# Altium project Capstone_Thermostat.PrjPcb
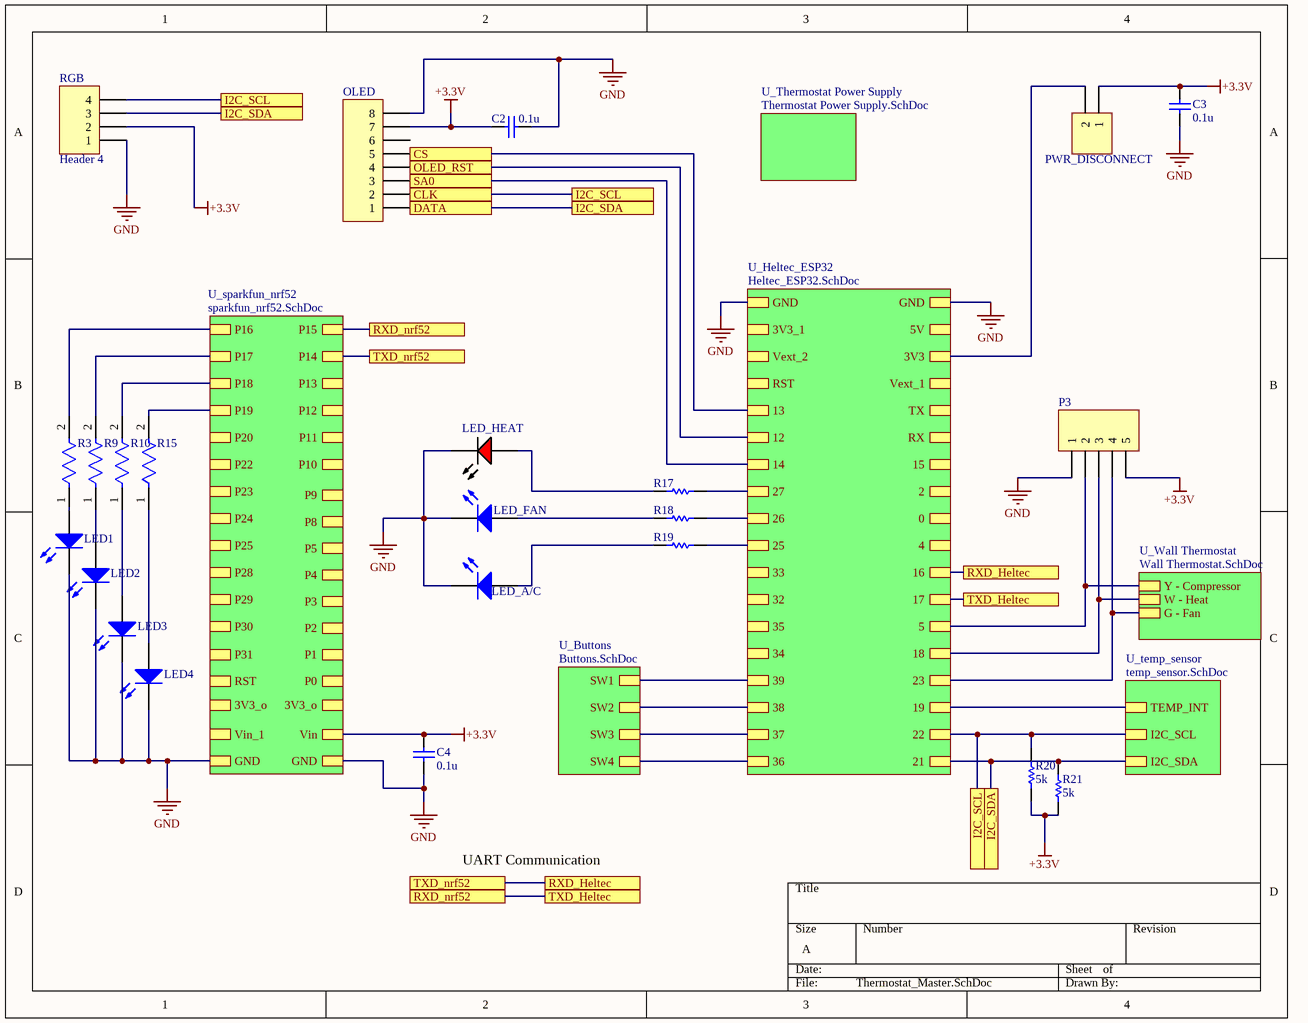
[diagram p0: Thermostat_Master.SchDoc]
7 sheets, 75 parts. Net scope: hierarchical (ports join the sheet entries above them; power ports are global).
Board file: Thermostat_PCB.PcbDoc
Sheets:
  Thermostat_Master.SchDoc
    U_sparkfun_nrf52 = sparkfun_nrf52.SchDoc
    U_Heltec_ESP32 = Heltec_ESP32.SchDoc
    U_temp_sensor = temp_sensor.SchDoc
    U_Wall Thermostat = Wall Thermostat.SchDoc
    U_Thermostat Power Supply = Thermostat Power Supply.SchDoc
    U_Buttons = Buttons.SchDoc

## Sheet Thermostat_Master.SchDoc
size A

### Parts
C2  0.1u  [CAPC2013X145X50LL20T25]
C3  0.1u  [CAPC2013X145X50LL20T25]
C4  0.1u  [CAPC2013X145X50LL20T25]
LED1  (no value)  [1206_A]
LED2  (no value)  [1206_A]
LED3  (no value)  [1206_A]
LED4  (no value)  [1206_A]
LED_A/C  (no value)  [1206_A]
LED_FAN  (no value)  [1206_A]
LED_HEAT  LTST-C150KRKT  [LTST-C150KRKT_V]  (value not drawn)
OLED  Header 8  [HDR1X8]  (value not drawn)
P3  Header 5  [HDR1X5]  (value not drawn)
PWR_DISCONNECT  Header 2  [HDR1X2]  (value not drawn)
R3  (no value)  [FP-RC1206-MFG]
R9  (no value)  [FP-RC1206-MFG]
R10  (no value)  [FP-RC1206-MFG]
R15  (no value)  [FP-RC1206-MFG]
R17  RC0805FR-07100RL  [RESC2013X60X35ML10T20]  (value not drawn)
R18  RC0805FR-07100RL  [RESC2013X60X35ML10T20]  (value not drawn)
R19  RC0805FR-07100RL  [RESC2013X60X35ML10T20]  (value not drawn)
R20  5k  [RESC2013X70X40LL20T20]
R21  5k  [RESC2013X70X40LL20T20]
RGB  Header 4  [HDR1X4]

### Sub-sheets
U_Buttons = Buttons.SchDoc: SW1, SW3, SW4, SW2
U_Heltec_ESP32 = Heltec_ESP32.SchDoc: GND, 5V, 3V3, Vext_1, TX, RX, 15, 2, 0, 4, 16, 17, 5, 18, 23, 19, 22, 21, GND, 3V3_1, Vext_2, RST, 13, 12, 14, 27, 26, 25, 33, 32, 35, 34, 39, 38, 37, 36
U_sparkfun_nrf52 = sparkfun_nrf52.SchDoc: P16, P17, P18, P19, P20, P22, P23, P24, P25, P28, P29, P30, P31, RST, Vin_1, GND, P15, P14, P13, P12, P11, P10, P9, P8, P5, P4, P3, P2, P1, P0, GND, 3V3_o, 3V3_o, Vin
U_temp_sensor = temp_sensor.SchDoc: I2C_SCL, TEMP_INT, I2C_SDA
U_Thermostat Power Supply = Thermostat Power Supply.SchDoc: no entries
U_Wall Thermostat = Wall Thermostat.SchDoc: Y - Compressor, W - Heat, G - Fan

### Ports
CLK, CS, DATA, I2C_SCL, I2C_SDA, OLED_RST, RXD_Heltec, RXD_nrf52, SA0, TXD_Heltec, TXD_nrf52

### Nets
+3.3V: C2.2 C3.2 C4.2 OLED.7 P3.5 PWR_DISCONNECT.1 R20.1 R21.1 RGB.2 ; sheet U_sparkfun_nrf52/Vin
GND: C2.1 C3.1 C4.1 LED1.1(K) LED2.1(K) LED3.1(K) LED4.1(K) LED_A/C.1(K) LED_FAN.1(K) LED_HEAT.2(K) OLED.8 P3.1 RGB.1 ; sheet U_sparkfun_nrf52/GND, sheet U_sparkfun_nrf52/GND, sheet U_Heltec_ESP32/GND, sheet U_Heltec_ESP32/GND
NetLED1_2: LED1.2(A) R3.1
NetLED2_2: LED2.2(A) R9.1
NetLED3_2: LED3.2(A) R10.1
NetLED4_2: LED4.2(A) R15.1
NetLED_A/C_2: LED_A/C.2(A) R19.1
NetLED_FAN_2: LED_FAN.2(A) R18.1
NetLED_HEAT_1: LED_HEAT.1(A) R17.1
NetOLED_1: OLED.1 R21.2 RGB.3 ; port DATA, port I2C_SDA, sheet U_Heltec_ESP32/21, sheet U_temp_sensor/I2C_SDA
NetOLED_2: OLED.2 R20.2 RGB.4 ; port CLK, port I2C_SCL, sheet U_Heltec_ESP32/22, sheet U_temp_sensor/I2C_SCL
NetOLED_3: OLED.3 ; port SA0, sheet U_Heltec_ESP32/14
NetOLED_4: OLED.4 ; port OLED_RST, sheet U_Heltec_ESP32/12
NetOLED_5: OLED.5 ; port CS, sheet U_Heltec_ESP32/13
NetP1_8: R17.2 ; sheet U_Heltec_ESP32/27
NetP1_9: R18.2 ; sheet U_Heltec_ESP32/26
NetP1_10: R19.2 ; sheet U_Heltec_ESP32/25
NetP1_15: sheet U_Heltec_ESP32/39, sheet U_Buttons/SW1
NetP1_16: sheet U_Heltec_ESP32/38, sheet U_Buttons/SW2
NetP1_17: sheet U_Heltec_ESP32/37, sheet U_Buttons/SW3
NetP1_18: sheet U_Heltec_ESP32/36, sheet U_Buttons/SW4
NetP2_3: sheet U_Heltec_ESP32/19, sheet U_temp_sensor/TEMP_INT
NetP2_4: P3.4 ; sheet U_Heltec_ESP32/23, sheet U_Wall Thermostat/G - Fan
NetP2_5: P3.3 ; sheet U_Heltec_ESP32/18, sheet U_Wall Thermostat/W - Heat
NetP2_6: P3.2 ; sheet U_Heltec_ESP32/5, sheet U_Wall Thermostat/Y - Compressor
NetP2_7: port TXD_Heltec, port RXD_nrf52, sheet U_sparkfun_nrf52/P15, sheet U_Heltec_ESP32/17
NetP2_8: port RXD_Heltec, port TXD_nrf52, sheet U_sparkfun_nrf52/P14, sheet U_Heltec_ESP32/16
NetP2_16: PWR_DISCONNECT.2 ; sheet U_Heltec_ESP32/3V3
NetPL1_3: sheet U_sparkfun_nrf52/3V3_o, sheet U_sparkfun_nrf52/3V3_o
NetPL1_14: R15.2 ; sheet U_sparkfun_nrf52/P19
NetPL1_15: R10.2 ; sheet U_sparkfun_nrf52/P18
NetPL1_16: R9.2 ; sheet U_sparkfun_nrf52/P17
NetPL1_17: R3.2 ; sheet U_sparkfun_nrf52/P16

Not connected (* = marked no-connect by the designer): OLED 6

### Notes on the sheet
- UART Communication

### Library data of the parts
C2-C4 = CMP-2007-01258-1: C0805C104Z5VACTU; Manufacturer: Kemet; Part Number: C0805C104Z5VACTU
LED1-LED4 = CMP-1426-00016-1: QTLP650C4TR / 1206 green led; PartNumber: 150120VS75000; Manufacturer: Wuerth Elektronik; Color: Bright Green; ComponentLink2URL: http://katalog.we-online.com/led/datasheet/150120VS75000.pdf; ComponentLink2Description: Datasheet; ComponentLink1URL: http://www.we-online.com; PackageReference: 1206_A; ComponentLink1Description: Manufacturer URL
LED_A/C = CMP-1426-00016-1: QTLP650C4TR / 1206 green led; PartNumber: LTST-C150TBKT; ComponentLink2URL: http://katalog.we-online.com/led/datasheet/150120VS75000.pdf; Color: Blue; ComponentLink2Description: Datasheet; ComponentLink1URL: http://www.we-online.com; PackageReference: 1206_A; ComponentLink1Description: Manufacturer URL
LED_FAN = CMP-1426-00016-1: LTST-C150GKT / 1206 green led; ComponentLink2URL: http://katalog.we-online.com/led/datasheet/150120VS75000.pdf; PartNumber: LTST-C150GKT; Color: Bright Green; ComponentLink2Description: Datasheet; ComponentLink1URL: http://www.we-online.com; PackageReference: 1206_A; ComponentLink1Description: Manufacturer URL
LED_HEAT = CMP-2000-06617-1: LED Red, 62.5 mW, 50 mA, -30 to 85 degC, 2-Pin SMD, RoHS, Tape and Reel; Manufacturer: Lite-On; Chip Material: AlGaInP; Product Depth (mm): 1.6mm; Luminous Intensity: 54mcd; Number of  Elements: 1; Reverse Voltage: 5V; Viewing Angle: 130deg; Rad Hardened: No; Shape Type: Rectangular; Peak Wavelength: 639nm; Forward Current: 30mA; Main Category: ChipLED; Product Height (mm): 1.1mm; Forward Voltage: 2.4V; Product Length (mm): 3.2mm; High Brightness: Yes; DELETED: Compliant; Test Current (It): 20mA; Power Dissipation: 75W; Dominant Wave Length: 631nm; Mounting: SurfaceMount; Package Type: ChipLed; Manufacturer URL: http://www.us.liteon.com/; Datasheet Version: Rev. C, 01/2013; Lens Dimensions: 2.06X1.6X0.6mm; Package Reference: C150KRKT; Operating Temp Range: -55Cto85C; Packaging: TapeandReel; Package Description: 2-Pin Surface Mount Device, Body 3.2 x 1.6 mm; Lum Intensity: 54mcd; Datasheet URL: http://optoelectronics.liteon.com/upload/download/DS-22-99-0149/S_110_LTST-C150KRKT.pdf; Emitting Color: Red; Operating Temperature Classification: Industrial; Mounting Technology: SurfaceMount; Type: Uni-Color; Pin Count: 2
OLED = Header 8: Header, 8-Pin; LatestRevisionDate: 17-Jul-2002; LatestRevisionNote: Re-released for DXP Platform.; Publisher: Altium Limited
P3 = Header 5: Header, 5-Pin; LatestRevisionDate: 17-Jul-2002; LatestRevisionNote: Re-released for DXP Platform.; Publisher: Altium Limited
PWR_DISCONNECT = Header 2: Header, 2-Pin; LatestRevisionDate: 17-Jul-2002; LatestRevisionNote: Re-released for DXP Platform.; Publisher: Altium Limited
R3 R9 R10 R15 = CMP-03412-007570-1: 360 ohms resistor / 1206 package; Manufacturer Part Number: RC1206JR-070RL; Manufacturer: YAGEO; Voltage Rating: 200V; Temperature Coefficient: 300ppm/°C; Power Rating: 0.25W; Value: 0Ω; Tolerance: 5%; Temperature Range Low: -55°C; Category: Res; Automotive: No; Ipc Land Pattern Name: RESC310160X55; Device Class L1: Passive Components; Temperature: -55°C to +155°C; ComponentLink2URL: https://www.yageo.com/upload/media/product/productsearch/datasheet/rchip/PYu-RC_Group_51_RoHS_L_10.pdf; Lead Free: Yes; Height: 0.65mm; Footprint Url: https://www.yageo.com/upload/website/yageo_PYu-R_Mount_10_19050818_343.pdf; Package: RC1206; Digikey Description: RES SMD 0 OHM JUMPER 1/4W 1206; Temperature Range High: +155°C; Device Class L3: Chip SMD Resistors; Device Class L2: Resistors; Octopart: https://octopart.com/rc1206jr-070rl-yageo-40025601; Resistance: 0Ω; Series: RC; ComponentLink2Description: Datasheet; Composition: Thick Film; RoHS: TRUE; Mouser Description: Resistor: thick film; SMD; 1206; 0O; 0.25W; ±5%; -55÷155°C
R17-R19 = CMP-2100-03669-1: Chip Resistor, 100 Ohm, +/-1%, 0.125 W, -55 to 155 degC, 0805 (2012 Metric), RoHS, Tape and Reel; Manufacturer: Yageo; Power Rating: 125mW; Resistance: 100Ohm; Voltage Rating: 150V; Tolerance: 1%; Temperature Coefficient: 100ppm/degreesC; Length: 2mm; Package Description: 2-Pin Surface Mounted Device, Body 2 x 1.25 mm; Case Code (Imperial): 0805; Number of Pins: 2; Termination: SMD/SMT; Lead Pitch: 0.4mm; Package Quantity: 1; Height: 0.024inch; Case Code (Metric): 2012; Number of Terminations: 2; Datasheet Version: Rev. 5, 10/2016; Lead Free: LeadFree; Package Reference: 0805; Composition: ThickFilm; REACH SVHC: Unknown; Voltage Rating (DC): 150V; Min Operating Temperature: -55degC; Packaging: TapeandReel; Military Standard: Not; Case/Package: 0805; Datasheet URL: http://www.yageo.com/NewPortal/yageodocoutput?fileName=/pdf/R-Chip/PYu-RC_Group_51_RoHS_L_5.pdf; Max Operating Temperature: 155degC; Manufacturer URL: http://www.yageo.com/; Max Power Dissipation: 125mW; Width: 0.049inch; Depth: 1.25mm; RoHSCompliant: true
R20 R21 = CMP-2001-00419-1: 2012; Part Number: ERJ-6GEYJ471V; Manufacturer: Panasonic
RGB = Header 4: Header, 4-Pin; LatestRevisionDate: 17-Jul-2002; LatestRevisionNote: Re-released for DXP Platform.; Publisher: Altium Limited

## Sheet sparkfun_nrf52.SchDoc
size A4
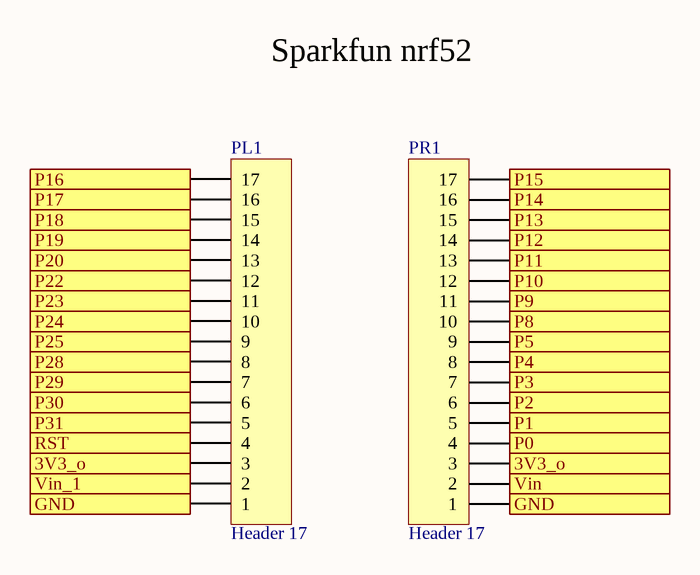
[diagram p1: sparkfun_nrf52.SchDoc]

### Parts
PL1  Header 17  [HDR1X17]
PR1  Header 17  [HDR1X17]

### Ports
3V3_o, GND, P0, P1, P2, P3, P4, P5, P8, P9, P10, P11, P12, P13, P14, P15, P16, P17, P18, P19, P20, P22, P23, P24, P25, P28, P29, P30, P31, RST, Vin, Vin_1

### Nets
+3.3V: PR1.2 ; port Vin
GND: PL1.1 PR1.1 ; port GND
NetP2_7: PR1.17 ; port P15
NetP2_8: PR1.16 ; port P14
NetPL1_2: PL1.2 ; port Vin_1
NetPL1_3: PL1.3 PR1.3 ; port 3V3_o
NetPL1_4: PL1.4 ; port RST
NetPL1_5: PL1.5 ; port P31
NetPL1_6: PL1.6 ; port P30
NetPL1_7: PL1.7 ; port P29
NetPL1_8: PL1.8 ; port P28
NetPL1_9: PL1.9 ; port P25
NetPL1_10: PL1.10 ; port P24
NetPL1_11: PL1.11 ; port P23
NetPL1_12: PL1.12 ; port P22
NetPL1_13: PL1.13 ; port P20
NetPL1_14: PL1.14 ; port P19
NetPL1_15: PL1.15 ; port P18
NetPL1_16: PL1.16 ; port P17
NetPL1_17: PL1.17 ; port P16
NetPR1_4: PR1.4 ; port P0
NetPR1_5: PR1.5 ; port P1
NetPR1_6: PR1.6 ; port P2
NetPR1_7: PR1.7 ; port P3
NetPR1_8: PR1.8 ; port P4
NetPR1_9: PR1.9 ; port P5
NetPR1_10: PR1.10 ; port P8
NetPR1_11: PR1.11 ; port P9
NetPR1_12: PR1.12 ; port P10
NetPR1_13: PR1.13 ; port P11
NetPR1_14: PR1.14 ; port P12
NetPR1_15: PR1.15 ; port P13

### Notes on the sheet
- Sparkfun nrf52

### Library data of the parts
PL1 PR1 = Header 17: Header, 17-Pin; LatestRevisionDate: 17-Jul-2002; LatestRevisionNote: Re-released for DXP Platform.; Publisher: Altium Limited

## Sheet Heltec_ESP32.SchDoc
size A
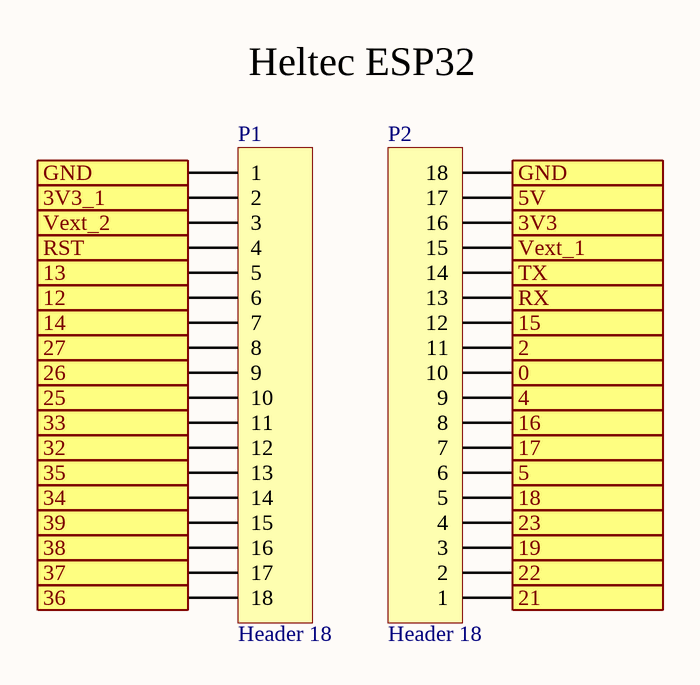
[diagram p2: Heltec_ESP32.SchDoc]

### Parts
P1  Header 18  [HDR1X18]
P2  Header 18  [HDR1X18]

### Ports
0, 2, 3V3, 3V3_1, 4, 5, 5V, 12, 13, 14, 15, 16, 17, 18, 19, 21, 22, 23, 25, 26, 27, 32, 33, 34, 35, 36, 37, 38, 39, GND, RST, RX, TX, Vext_1, Vext_2

### Nets
GND: P1.1 P2.18 ; port GND
NetOLED_1: P2.1 ; port 21
NetOLED_2: P2.2 ; port 22
NetOLED_3: P1.7 ; port 14
NetOLED_4: P1.6 ; port 12
NetOLED_5: P1.5 ; port 13
NetP1_2: P1.2 ; port 3V3_1
NetP1_3: P1.3 ; port Vext_2
NetP1_4: P1.4 ; port RST
NetP1_8: P1.8 ; port 27
NetP1_9: P1.9 ; port 26
NetP1_10: P1.10 ; port 25
NetP1_11: P1.11 ; port 33
NetP1_12: P1.12 ; port 32
NetP1_13: P1.13 ; port 35
NetP1_14: P1.14 ; port 34
NetP1_15: P1.15 ; port 39
NetP1_16: P1.16 ; port 38
NetP1_17: P1.17 ; port 37
NetP1_18: P1.18 ; port 36
NetP2_3: P2.3 ; port 19
NetP2_4: P2.4 ; port 23
NetP2_5: P2.5 ; port 18
NetP2_6: P2.6 ; port 5
NetP2_7: P2.7 ; port 17
NetP2_8: P2.8 ; port 16
NetP2_9: P2.9 ; port 4
NetP2_10: P2.10 ; port 0
NetP2_11: P2.11 ; port 2
NetP2_12: P2.12 ; port 15
NetP2_13: P2.13 ; port RX
NetP2_14: P2.14 ; port TX
NetP2_15: P2.15 ; port Vext_1
NetP2_16: P2.16 ; port 3V3
NetP2_17: P2.17 ; port 5V

### Notes on the sheet
- Heltec ESP32

### Library data of the parts
P1 P2 = Header 18: Header, 18-Pin; LatestRevisionDate: 17-Jul-2002; LatestRevisionNote: Re-released for DXP Platform.; Publisher: Altium Limited

## Sheet temp_sensor.SchDoc
size A4
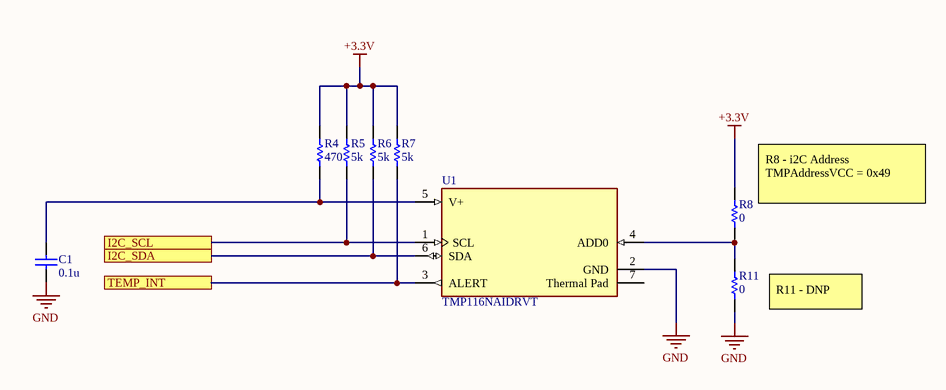
[diagram p3: temp_sensor.SchDoc]

### Parts
C1  0.1u  [CAPC2013X145X50LL20T25]
R4  470  [RESC2013X70X40LL20T20]
R5  5k  [RESC2013X70X40LL20T20]
R6  5k  [RESC2013X70X40LL20T20]
R7  5k  [RESC2013X70X40LL20T20]
R8  0  [RESC2013X70X40LL20T20]
R11  0  [RESC2013X70X40LL20T20]
U1  TMP116NAIDRVT  [FP-DRV0006A-MFG]

### Ports
I2C_SCL, I2C_SDA, TEMP_INT

### Nets
+3.3V: R4.2 R5.2 R6.2 R7.2 R8.2
GND: C1.1 R11.1 U1.2(GND)
NetC1_2: C1.2 R4.1 U1.5(V+)
NetOLED_1: R6.1 U1.6(SDA) ; port I2C_SDA
NetOLED_2: R5.1 U1.1(SCL) ; port I2C_SCL
NetP2_3: R7.1 U1.3(ALERT) ; port TEMP_INT
NetR8_1: R8.1 R11.2 U1.4(ADD0)

Not connected (* = marked no-connect by the designer): U1 7(Thermal_Pad)

### Notes on the sheet
- (near R8) R8 - i2C Address TMPAddressVCC = 0x49
- (near R11) R11 - DNP

### Library data of the parts
C1 = CMP-2007-01258-1: C0805C104Z5VACTU; Manufacturer: Kemet; Part Number: C0805C104Z5VACTU
R4 = CMP-2001-00419-1: ERJ-6GEYJ471V; Manufacturer: Panasonic; Part Number: ERJ-6GEYJ471V
R5-R8 R11 = CMP-2001-00419-1: as R20 on sheet Thermostat_Master
U1 = CMP-04948-000020-1: SENSOR DIGITAL -55C-125C 6WSON; Manufacturer: Texas Instruments; Max Supply Voltage: 5.5V; Min Supply Voltage: 1.9V; Standoff Height: 0mm; Accuracy: 0.2%; Operating Supply Current: 3.5-135uA; Max Junction Temp: +150°C; Interface: I2C,SMBus; Resolution: 16bits; Temperature Range High: +125°C; Device Class L1: Sensors; Package: DRV0006A; Temperature Range Low: -55°C; Lead Free: Yes; Digikey Description: SENSOR DIGITAL -55C-125C 6WSON; RoHS: TRUE; Height: 0.8mm; Ambient Temperature Range High: +150°C; Temperature: -55°C to +125°C; ComponentLink2Description: Datasheet; Device Class L3: unset; Ambient Temperature Range Low: -55°C; Category: IC; Octopart: https://octopart.com/tmp116naidrvt-texas+instruments-82367759; Device Class L2: Temperature and Humidity Sensors; Manufacturer Part Number: TMP116NAIDRVT; ComponentLink2URL: http://www.ti.com/lit/ds/symlink/tmp116.pdf; Automotive: No

## Sheet Wall Thermostat.SchDoc: Thermostat Relay Circuit
size A; Author: Liam Robinson; DrawnBy: Liam Robinson; DocumentNumber: 1; Revision: 1.0; SheetNumber: 1; SheetTotal: 1
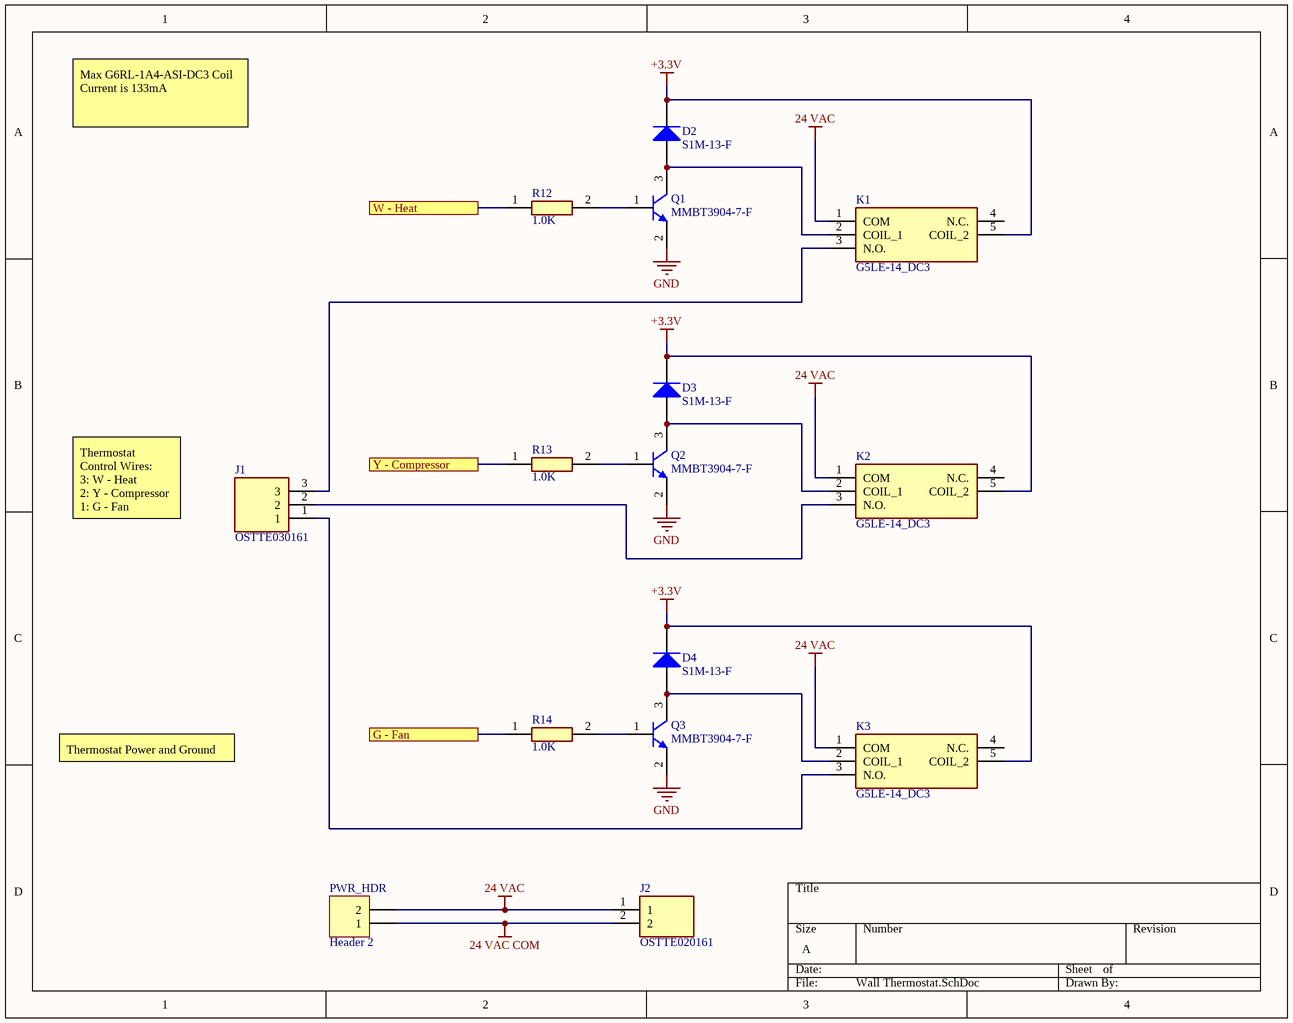
[diagram p4: Wall Thermostat.SchDoc]

### Parts
D2  S1M-13-F  [DIOD-S1M-13-F-SMA-2_V]
D3  S1M-13-F  [DIOD-S1M-13-F-SMA-2_V]
D4  S1M-13-F  [DIOD-S1M-13-F-SMA-2_V]
J1  OSTTE030161  [SHDR3W90P0X350_1X3_1150X700X840P]
J2  OSTTE020161  [SHDR2W90P0X350_1X2_800X700X855P]
K1  G5LE-14_DC3  [G5LE-14_SPDT]
K2  G5LE-14_DC3  [G5LE-14_SPDT]
K3  G5LE-14_DC3  [G5LE-14_SPDT]
PWR_HDR  Header 2  [HDR1X2]
Q1  MMBT3904-7-F  [DIOD-SOT23-3_V]
Q2  MMBT3904-7-F  [DIOD-SOT23-3_V]
Q3  MMBT3904-7-F  [DIOD-SOT23-3_V]
R12  1.0K  [RESC2012X60N]
R13  1.0K  [RESC2012X60N]
R14  1.0K  [RESC2012X60N]

### Ports
G - Fan, W - Heat, Y - Compressor

### Nets
24 VAC: J2.1 K1.1(COM) K2.1(COM) K3.1(COM) PWR_HDR.2
24 VAC COM: J2.2 PWR_HDR.1
+3.3V: D2.2(K) D3.2(K) D4.2(K) K1.5(COIL_2) K2.5(COIL_2) K3.5(COIL_2)
GND: Q1.2(E) Q2.2(E) Q3.2(E)
NetD2_1: D2.1(A) K1.2(COIL_1) Q1.3(C)
NetD3_1: D3.1(A) K2.2(COIL_1) Q2.3(C)
NetD4_1: D4.1(A) K3.2(COIL_1) Q3.3(C)
NetJ1_1: J1.1 K3.3(N.O.)
NetJ1_2: J1.2 K2.3(N.O.)
NetJ1_3: J1.3 K1.3(N.O.)
NetP2_4: R14.1 ; port G - Fan
NetP2_5: R12.1 ; port W - Heat
NetP2_6: R13.1 ; port Y - Compressor
NetQ1_1: Q1.1(B) R12.2
NetQ2_1: Q2.1(B) R13.2
NetQ3_1: Q3.1(B) R14.2

Not connected (* = marked no-connect by the designer): K1 4(N.C.); K2 4(N.C.); K3 4(N.C.)

### Notes on the sheet
- Max G6RL-1A4-ASI-DC3 Coil Current is 133mA
- Thermostat Control Wires:
  3: W - Heat
  2: Y - Compressor
  1: G - Fan
- Thermostat Power and Ground

### Library data of the parts
D2-D4 = CMP-0639-00001-1: Surface Mount Glass Passivated Rectifier, 1000V, 1 A, -65 to 125 degC, 2-Pin SMA Package, RoHS, Tape and Reel; Manufacturer: Diodes Inc; Maximum Reverse Current IR (uA): 5; Maximum Peak Forward Surge Current IFSM (A): 30; Maximum Average Rectified Current IO (A): 1; Peak Repetitive Reverse Voltage VRRM (V): 1000; Total Capacitance CT (pF): 10; Forward Voltage Drop VF (V): 1.1; ComponentLink1URL: http://www.diodes.com/; Operating Temperature Range: -65 to 150 degC; ComponentLink3URL: http://diodes.com/datasheets/ds16003.pdf; ComponentLink3Description: Package Specification; PackageDescription: 2-Pin SMD, Body 4.3 x 2.605 mm, Height 2.3 mm; Mounting Technology: Surface Mount; ComponentLink1Description: Manufacturer URL; PackageReference: S1M-13-F-SMA-2; ComponentLink2URL: http://diodes.com/datasheets/ds16003.pdf; ComponentLink2Description: Datasheet; RoHS: TRUE; DatasheetVersion: Rev. 22 - 2; Packing: Tape and Reel; PackageVersion: Rev. 22 - 2; PartNumber: S1M-13-F
J1 = OSTTE030161: Connector; Manufacturer_Name: On-Shore Technology; Datasheet Link: https://www.arrow.com/en/products/ostte030161/on-shore-technology; Height: 8.4mm; Manufacturer_Part_Number: OSTTE030161; Arrow Part Number: OSTTE030161; Arrow Price/Stock: https://www.arrow.com/en/products/ostte030161/on-shore-technology
J2 = OSTTE020161: Connector; Manufacturer_Name: On-Shore Technology; Datasheet Link: http://www.on-shore.com/wp-content/uploads/OSTTEXX0161.pdf; Height: 8.55mm; Manufacturer_Part_Number: OSTTE020161; Arrow Part Number: OSTTE020161; Arrow Price/Stock: https://www.arrow.com/en/products/ostte020161/on-shore-technology
K1-K3 = G5LE-14_DC3: Relay or Contactor; Manufacturer_Name: Omron Electronics; Manufacturer_Part_Number: G5LE-14 DC3; Datasheet Link: https://omronfs.omron.com/en_US/ecb/products/pdf/en-g5le.pdf; Arrow Part Number: G5LE-14 DC3; Mouser Part Number: 653-G5LE-14DC3; Mouser Price/Stock: https://www.mouser.com/Search/Refine.aspx?Keyword=653-G5LE-14DC3
PWR_HDR = Header 2: Header, 2-Pin; LatestRevisionDate: 17-Jul-2002; LatestRevisionNote: Re-released for DXP Platform.; Publisher: Altium Limited
Q1-Q3 = CMP-2000-04931-1: NPN Small Signal Transistor, 40 V, 0.2 A, -55 to 150 degC, 3-Pin SOT23, RoHS, Tape and Reel; Manufacturer: DiodesIncorporated; Maximum DC Collector Current: 0.2A; Collector- Base Voltage VCBO: 60V; Collector- Emitter Voltage VCEO Max: 40V; Unit Weight: 0.000282oz; Emitter- Base Voltage VEBO: 6V; DC Collector/Base Gain hfe Min: 100; Collector-Emitter Saturation Voltage: 0.3V; Gain Bandwidth Product fT: 300MHz; DC Current Gain hFE Max: 300; Configuration: Single; Pd - Power Dissipation: 310mW; Series: MMBT3904; Width: 1.4mm; Package / Case: SOT-23; Mounting Style: SMD/SMT; Datasheet Version: Rev. 21-2, 11/2013; Package Reference: SOT23-3; Product Category: BipolarTransistors-BJT; Manufacturer URL: http://www.diodes.com/; Packaging: Reel; Brand: DiodesIncorporated; Package Description: 3-Pin Small Outline Transistor, Body 2.9 x 1.3 mm, Pitch 0.96 mm; Datasheet URL: http://download.siliconexpert.com/pdfs/2013/11/16/3/45/37/668/dds_/manual/1692ds30036.pdf; Height: 1mm; Maximum Operating Temperature: +150C; Factory Pack Quantity: 3000; Minimum Operating Temperature: -55C; Length: 3.05mm; Transistor Polarity: NPN; Continuous Collector Current: 0.2A; RoHS: True
R12-R14 = RC0805JR-071KL: Resistor; Manufacturer_Name: YAGEO (PHYCOMP); Datasheet Link: http://www.yageo.com/documents/recent/PYu-RC_Group_51_RoHS_L_10.pdf; Height: 0.6mm; Manufacturer_Part_Number: RC0805JR-071KL; Arrow Part Number: RC0805JR-071KL; Arrow Price/Stock: https://www.arrow.com/en/products/rc0805jr-071kl/yageo; Mouser Part Number: 603-RC0805JR-071KL; Mouser Price/Stock: https://www.mouser.co.uk/ProductDetail/Yageo/RC0805JR-071KL?qs=KyGMWp10UkuwbpWNcSKeOA%3D%3D

## Sheet Thermostat Power Supply.SchDoc
size A
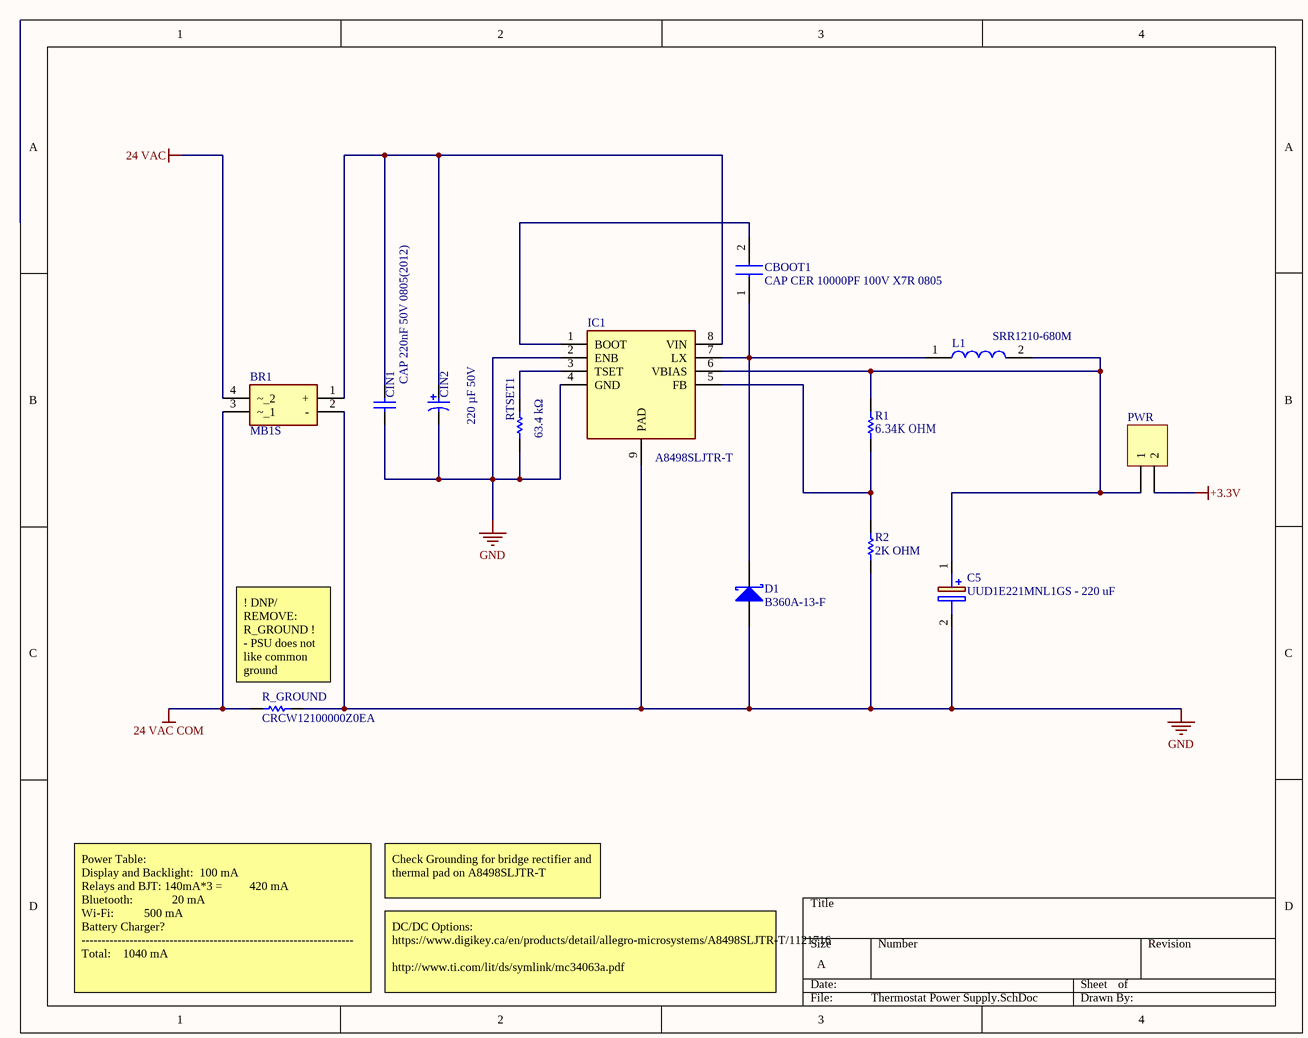
[diagram p5: Thermostat Power Supply.SchDoc]

### Parts
BR1  MB1S  [SOP245P670X290-4N]
C5  UUD1E221MNL1GS - 220 uF  [CAPAE830X1050N]
CBOOT1  CAP CER 10000PF 100V X7R 0805  [CAPC2012X88N]
CIN1  CAP 220nF 50V 0805(2012)  [CAPC0805(2012)145_N]
CIN2  220 µF 50V  [NIC-CAPA2-10X10_V]
D1  B360A-13-F  [DIOD-B360A_V]
IC1  A8498SLJTR-T  [SOIC127P600X170-9N]
L1  SRR1210-680M  [SRR1210]
PWR  Header 2  [HDR1X2]  (value not drawn)
R1  ‎6.34K OHM ‎  [RESC2013X60X35NL10T20]
R2  2K OHM  [RESC2013X60X35ML10T20]
R_GROUND  CRCW12100000Z0EA  [RESC3225X60X45NL20T20]
RTSET1  63.4 kΩ  [RESC2013X60X40NL20T25]

### Nets
24 VAC: BR1.4(~_2)
24 VAC COM: BR1.3(~_1) R_GROUND.1
+3.3V: PWR.2
GND: BR1.2(-) C5.2(-) CIN1.1 CIN2.2 D1.1(A) IC1.2(ENB) IC1.4(GND) IC1.9(PAD) R2.1 R_GROUND.2 RTSET1.1
NetBR1_1: BR1.1(+) CIN1.2 CIN2.1 IC1.8(VIN)
NetC5_1: C5.1(+) IC1.6(VBIAS) L1.2 PWR.1 R1.2
NetCBOOT1_1: CBOOT1.1 D1.2(K) IC1.7(LX) L1.1
NetCBOOT1_2: CBOOT1.2 IC1.1(BOOT)
NetIC1_3: IC1.3(TSET) RTSET1.2
NetIC1_5: IC1.5(FB) R1.1 R2.2

### Notes on the sheet
- (near R_GROUND) ! DNP/ REMOVE: R_GROUND !
  - PSU does not like common ground
- Check Grounding for bridge rectifier and thermal pad on A8498SLJTR-T
- Power Table:
  Display and Backlight: 	100 mA
  Relays and BJT: 140mA*3 =         420 mA
  Bluetooth:		           20 mA
  Wi-Fi:			       500 mA
  Battery Charger?
  --------------------------------------------------------------------
  Total:			 1040 mA
- DC/DC Options:
  https://www.digikey.ca/en/products/detail/allegro-microsystems/A8498SLJTR-T/1121716
  http://www.ti.com/lit/ds/symlink/mc34063a.pdf

### Library data of the parts
BR1 = MB1S: Bridge Rectifier; Manufacturer_Name: ON Semiconductor; Datasheet Link: http://www.onsemi.com/pub/Collateral/MB8S-D.PDF; Height: 2.9mm; Manufacturer_Part_Number: MB1S; Arrow Part Number: MB1S; Arrow Price/Stock: https://www.arrow.com/en/products/mb1s/on-semiconductor; Mouser Part Number: 512-MB1S; Mouser Price/Stock: https://www.mouser.co.uk/ProductDetail/ON-Semiconductor-Fairchild/MB1S?qs=DPwKKv7J1fwyOHno5d2nnw%3D%3D
C5 = UUD1E221MNL1GS: Capacitor Polarised; Manufacturer_Name: Nichicon; Datasheet Link: https://www.mouser.com/datasheet/2/293/e-uud-1513238.pdf; Height: 10.5mm; Manufacturer_Part_Number: UUD1E221MNL1GS; Arrow Part Number: UUD1E221MNL1GS; Arrow Price/Stock: https://www.arrow.com/en/products/uud1e221mnl1gs/nichicon; Mouser Part Number: 647-UUD1E221MNL; Mouser Price/Stock: https://www.mouser.com/Search/Refine.aspx?Keyword=647-UUD1E221MNL
CBOOT1 = C0805C103K1RACTU: Capacitor; Manufacturer_Name: Kemet; Datasheet Link: http://uk.rs-online.com/web/p/products/2989309; Height: 0.88mm; Manufacturer_Part_Number: C0805C103K1RACTU; Arrow Part Number: C0805C103K1RACTU; Arrow Price/Stock: https://www.arrow.com/en/products/c0805c103k1ractu/kemet-corporation; Mouser Part Number: 80-C0805C103K1R; Mouser Price/Stock: https://www.mouser.co.uk/ProductDetail/KEMET/C0805C103K1RACTU?qs=5x48ZXzl2vJIYri9GAI7yw%3D%3D
CIN1 = CMP-1036-04552-1: CAP 220nF 50V ±10% 0805 (2012 Metric) Thickness 1.45mm SMD; Tolerance: Â±10%; Case-Metric: 2012; Case-EIA: 0805; Value: 220nF; Max Thickness: 1.45 mm; Technology: SMT; Rated Voltage: 50 V
CIN2 = CMP-0687-00004-1: Aluminum Electrolytic Capacitor, UD Series, Low Impedance, 220 uF, 50 V, + / - 20%, -55 to 105 degC, Chip Type, 10 x 10 mm D x L, Pb-Free, Reel; PartNumber: UUD1H221MNL1GS; Manufacturer: Nichicon; Rated Capacitance: 220 uF; Packing: Dia382mm Reel; Endurance Time: 5000 h; Rated Ripple Current (at 100kHz): 670 mA; Tolerance Rated Capacitance: -20 to 20%; Impedance: 0.18 Ohm; RoHS: TRUE; ComponentLink2URL: http://products.nichicon.co.jp/en/pdf/XJA043/e-ud.pdf; ComponentLink3URL: http://products.nichicon.co.jp/en/pdf/XJA043/e-ud.pdf; Mounting Technology: Surface Mount; ComponentLink1Description: Manufacturer URL; ComponentLink3Description: Package Specification; ComponentLink1URL: http://www.nichicon.co.jp/; Diameter: 10 mm; PackageDescription: 2-Pin Surface Mount Device, Diameter 10 mm, Height 10 mm, Pitch 8 mm; PackageReference: CAPAE-D10H10; ComponentLink2Description: Datasheet; Rated Voltage: 50 V; DatasheetVersion: 08/2012; Length: 10 mm
D1 = CMP-2000-05898-1: Schottky Barrier Rectifier, 3 A, -55 to 150 degC, 2-Pin Molded, RoHS, Tape and Reel; Manufacturer: DiodesIncorporated; Vf - Forward Voltage: 0.7V; Ifsm - Forward Surge Current: 80A; If - Forward Current: 3A; Unit Weight: 0.002258oz; Ir - Reverse Current: 500uA; Vrrm - Repetitive Reverse Voltage: 60V; Configuration: Single; Length: 4.6mm; Datasheet Version: Rev. 15-2, 09/2014; Technology: Si; Factory Pack Quantity: 5000; Manufacturer URL: http://www.diodes.com/; Type: SchottkyBarrierRectifier; Product Category: SchottkyDiodes&Rectifiers; Minimum Operating Temperature: -55C; Packaging: Reel; Product: SchottkyDiodes; Height: 2.3mm; Datasheet URL: https://datasheet.ciiva.com/914/ds30891-914080.pdf; Series: B360; Brand: DiodesIncorporated; Maximum Operating Temperature: +125C; Termination Style: SMD/SMT; Package / Case: SMA; Mounting Style: SMD/SMT; RoHS: True; Package Description: 2-Pin Surface Mount Device, Body 4.3 x 2.605 mm; Operating Temperature Range: -55Cto+125C; Package Reference: B360A; Width: 2.92mm; Mounting Technology: SurfaceMount
IC1 = A8498SLJTR-T: Integrated Circuit; Manufacturer_Name: Allegro Microsystems; Datasheet Link: http://www.allegromicro.com/~/media/files/datasheets/a8498-datasheet.ashx; Height: 1.7mm; Manufacturer_Part_Number: A8498SLJTR-T; Arrow Part Number: A8498SLJTR-T; Arrow Price/Stock: https://www.arrow.com/en/products/a8498sljtr-t/allegro-microsystems
L1 = SRR1210-680M: Inductor; Manufacturer_Name: Bourns; Datasheet Link: https://www.bourns.com/pdfs/SRR1210.pdf; Manufacturer_Part_Number: SRR1210-680M; Arrow Part Number: SRR1210-680M; Arrow Price/Stock: https://www.arrow.com/en/products/srr1210-680m/bourns; Mouser Part Number: 652-SRR1210-680M; Mouser Price/Stock: https://www.mouser.co.uk/ProductDetail/Bourns/SRR1210-680M?qs=4vvWAaIu%2Fq7jxuGAr15C2Q%3D%3D
PWR = Header 2: Header, 2-Pin; LatestRevisionDate: 17-Jul-2002; LatestRevisionNote: Re-released for DXP Platform.; Publisher: Altium Limited
R1 = CMP-2001-01252-1: RES 6.34K OHM; Manufacturer: Yageo; Part Number: RC0805FR-076R34L
R2 = CMP-2001-01361-1: Manufacturer: Yageo; Part Number: RC0805JR-072KL
R_GROUND = CMP-2005-01987-1: Manufacturer: Vishay Dale; Part Number: CRCW12100000Z0EA
RTSET1 = CMP-2001-00862-1: Manufacturer: Panasonic; Part Number: ERA6AEB6342V

## Sheet Buttons.SchDoc
size A
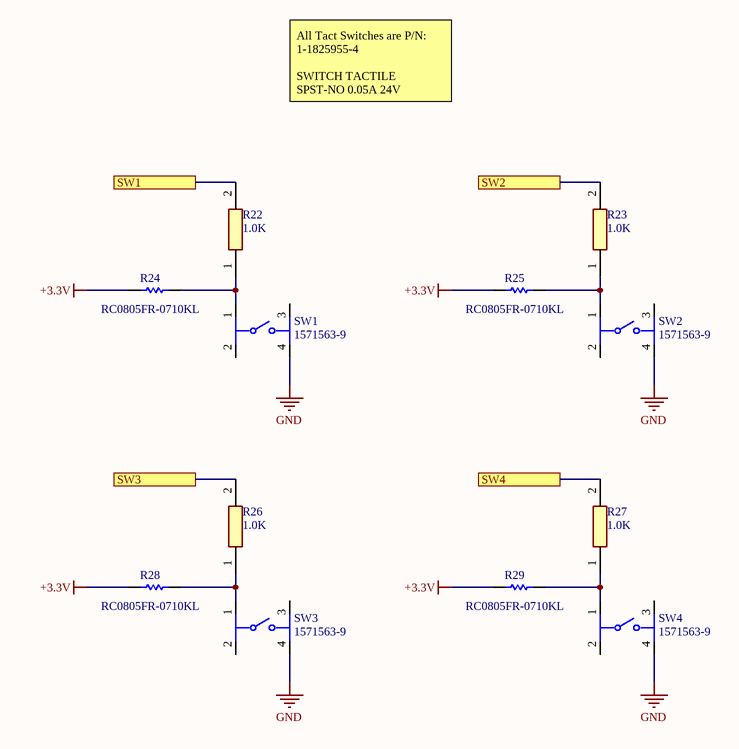
[diagram p6: Buttons.SchDoc]

### Parts
R22  1.0K  [RESC2012X60N]
R23  1.0K  [RESC2012X60N]
R24  RC0805FR-0710KL  [RESC2013X60X35NL10T20]
R25  RC0805FR-0710KL  [RESC2013X60X35NL10T20]
R26  1.0K  [RESC2012X60N]
R27  1.0K  [RESC2012X60N]
R28  RC0805FR-0710KL  [RESC2013X60X35NL10T20]
R29  RC0805FR-0710KL  [RESC2013X60X35NL10T20]
SW1  1571563-9  [FP-1571563-9-MFG]
SW2  1571563-9  [FP-1571563-9-MFG]
SW3  1571563-9  [FP-1571563-9-MFG]
SW4  1571563-9  [FP-1571563-9-MFG]

### Ports
SW1, SW2, SW3, SW4

### Nets
+3.3V: R24.1 R25.1 R28.1 R29.1
GND: SW1.4 SW2.4 SW3.4 SW4.4
NetP1_15: R22.2 ; port SW1
NetP1_16: R23.2 ; port SW2
NetP1_17: R26.2 ; port SW3
NetP1_18: R27.2 ; port SW4
NetR22_1: R22.1 R24.2 SW1.1
NetR23_1: R23.1 R25.2 SW2.1
NetR26_1: R26.1 R28.2 SW3.1
NetR27_1: R27.1 R29.2 SW4.1

Not connected (* = marked no-connect by the designer): SW1 2 3; SW2 2 3; SW3 2 3; SW4 2 3

### Notes on the sheet
- All Tact Switches are P/N: 1-1825955-4
  SWITCH TACTILE SPST-NO 0.05A 24V

### Library data of the parts
R22 R23 R26 R27 = RC0805JR-071KL: as R12 on sheet Wall Thermostat; Datasheet Link: http://www.yageo.com/documents/recent/PYu-RC_Group_51_RoHS_L_10.pdf; Height: 0.6mm; Manufacturer_Part_Number: RC0805JR-071KL; Arrow Part Number: RC0805JR-071KL; Arrow Price/Stock: https://www.arrow.com/en/products/rc0805jr-071kl/yageo; Mouser Part Number: 603-RC0805JR-071KL; Mouser Price/Stock: https://www.mouser.co.uk/ProductDetail/Yageo/RC0805JR-071KL?qs=KyGMWp10UkuwbpWNcSKeOA%3D%3D
R24 R25 R28 R29 = CMP-1659-00013-4: Chip Resistor, 10 KOhm, +/- 1%, 0.125 W, -55 to 155 degC, 0805 (2012 Metric), RoHS, Tape and Reel; Manufacturer: Yageo; Voltage Rating: 150 V; Mount: Surface Mount; ComponentLink1Description: Manufacturer URL; ComponentLink2URL: http://www.yageo.com/documents/recent/PYu-RC_Group_51_RoHS_L_04.pdf; Pins: 2; Length: 2 mm; Min Operating Temperature: -55 degC; Height: 0.5 mm; Mounting Technology: Surface Mount; RoHSCompliant: true; REACH SVHC: No SVHC; ComponentLink1URL: http://www.yageo.com/; Max Operating Temperature: 155 degC; PackageReference: 0805; DatasheetVersion: Rev. 4, 02/2016; Package Quantity: 5000; Packaging: Tape and Reel; ComponentLink2Description: Datasheet; PackageDescription: 2-Pin Surface Mounted Device, Body 2 x 1.25 mm
SW1-SW4 = CMP-03402-000005-1: SWITCH TACTILE SPST-NO 0.05A 24V; Manufacturer: TE Connectivity; Standoff Height: 0.05mm; Electromechanical Life: 100000Cycles; Contact Resistance: 100mΩ; Operating Force: 160gf; Contact Current Rating: 50mA; Automotive: No; Device Class L1: Electromechanical; Voltage Rating Dc: 24V; ComponentLink2Description: Datasheet; Mount: Surface Mount; RoHS: TRUE; Temperature: -35°C to +85°C; ComponentLink2URL: https://www.te.com/commerce/DocumentDelivery/DDEController?Action=showdoc&DocId=Customer+Drawing%7F2-1437565-7%7FV%7Fpdf%7FEnglish%7FENG_CD_2-1437565-7_V.pdf%7F1571563-9; Manufacturer Part Number: 1571563-9; Temperature Range Low: -35°C; Lead Free: Yes; Device Class L2: Switches; Package: SMT_SW_6MM0_6MM0; Octopart: https://octopart.com/1571563-9-te+connectivity-41253969; Throw Configuration: SPST-NO; Mouser Description: Tactile Switches SPST OFF(ON) RND SMT MINI PB TACT SWITCH; Temperature Range High: +85°C; Digikey Description: SWITCH TACTILE SPST-NO 0.05A 24V; Device Class L3: Pushbutton Switches; Category: Switch; Height: 9.75mm

## Nets that join several sheets
24 VAC: Wall Thermostat (5 pins), Thermostat Power Supply (BR1.4)
24 VAC COM: Wall Thermostat (J2.2 PWR_HDR.1), Thermostat Power Supply (BR1.3 R_GROUND.1)
+3.3V: Thermostat_Master (9 pins), sparkfun_nrf52 (PR1.2), temp_sensor (5 pins), Wall Thermostat (6 pins), Thermostat Power Supply (PWR.2), Buttons (R24.1 R25.1 R28.1 R29.1)
GND: Thermostat_Master (13 pins), sparkfun_nrf52 (PL1.1 PR1.1), Heltec_ESP32 (P1.1 P2.18), temp_sensor (C1.1 R11.1 U1.2), Wall Thermostat (Q1.2 Q2.2 Q3.2), Thermostat Power Supply (11 pins), Buttons (SW1.4 SW2.4 SW3.4 SW4.4)
NetOLED_1: Thermostat_Master (OLED.1 R21.2 RGB.3), Heltec_ESP32 (P2.1), temp_sensor (R6.1 U1.6)
NetOLED_2: Thermostat_Master (OLED.2 R20.2 RGB.4), Heltec_ESP32 (P2.2), temp_sensor (R5.1 U1.1)
NetOLED_3: Thermostat_Master (OLED.3), Heltec_ESP32 (P1.7)
NetOLED_4: Thermostat_Master (OLED.4), Heltec_ESP32 (P1.6)
NetOLED_5: Thermostat_Master (OLED.5), Heltec_ESP32 (P1.5)
NetP1_8: Thermostat_Master (R17.2), Heltec_ESP32 (P1.8)
NetP1_9: Thermostat_Master (R18.2), Heltec_ESP32 (P1.9)
NetP1_10: Thermostat_Master (R19.2), Heltec_ESP32 (P1.10)
NetP1_15: Heltec_ESP32 (P1.15), Buttons (R22.2)
NetP1_16: Heltec_ESP32 (P1.16), Buttons (R23.2)
NetP1_17: Heltec_ESP32 (P1.17), Buttons (R26.2)
NetP1_18: Heltec_ESP32 (P1.18), Buttons (R27.2)
NetP2_3: Heltec_ESP32 (P2.3), temp_sensor (R7.1 U1.3)
NetP2_4: Thermostat_Master (P3.4), Heltec_ESP32 (P2.4), Wall Thermostat (R14.1)
NetP2_5: Thermostat_Master (P3.3), Heltec_ESP32 (P2.5), Wall Thermostat (R12.1)
NetP2_6: Thermostat_Master (P3.2), Heltec_ESP32 (P2.6), Wall Thermostat (R13.1)
NetP2_7: sparkfun_nrf52 (PR1.17), Heltec_ESP32 (P2.7)
NetP2_8: sparkfun_nrf52 (PR1.16), Heltec_ESP32 (P2.8)
NetP2_16: Thermostat_Master (PWR_DISCONNECT.2), Heltec_ESP32 (P2.16)
NetPL1_14: Thermostat_Master (R15.2), sparkfun_nrf52 (PL1.14)
NetPL1_15: Thermostat_Master (R10.2), sparkfun_nrf52 (PL1.15)
NetPL1_16: Thermostat_Master (R9.2), sparkfun_nrf52 (PL1.16)
NetPL1_17: Thermostat_Master (R3.2), sparkfun_nrf52 (PL1.17)